# Altium project PCB_konvertor.PrjPcb
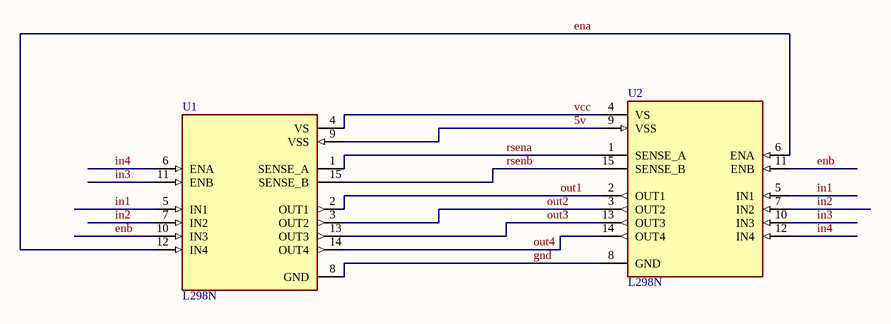
[diagram p0: Sheet1.SchDoc]
1 sheet, 2 parts. Net scope: global (net labels, ports and power ports of the same name join across sheets).
Board file: PCB_konvertora.PcbDoc

## Sheet Sheet1.SchDoc
size A4

### Parts
U1  L298N  [l298n]
U2  L298N  [l298n]

### Nets
5v: U1.9(VSS) U2.9(VSS)
ena: U1.12(IN4) U2.6(ENA)
enb: U1.10(IN3) U2.11(ENB)
gnd: U1.8(GND) U2.8(GND)
in1: U1.5(IN1) U2.5(IN1)
in2: U1.7(IN2) U2.7(IN2)
in3: U1.11(ENB) U2.10(IN3)
in4: U1.6(ENA) U2.12(IN4)
out1: U1.2(OUT1) U2.2(OUT1)
out2: U1.3(OUT2) U2.3(OUT2)
out3: U1.13(OUT3) U2.13(OUT3)
out4: U1.14(OUT4) U2.14(OUT4)
rsena: U1.1(SENSE_A) U2.1(SENSE_A)
rsenb: U1.15(SENSE_B) U2.15(SENSE_B)
vcc: U1.4(VS) U2.4(VS)

### Library data of the parts
U1 U2 = L298N: Dual Full Bridge Motor Driver 15-Pin(15+Tab) MULTIWATT V Tube; MP: L298N; Availability: Unavailable; Package: None; Value: *; Price: None